# EAGLE design motorthing-tmcm-1110 (EAGLE 7.5.0)
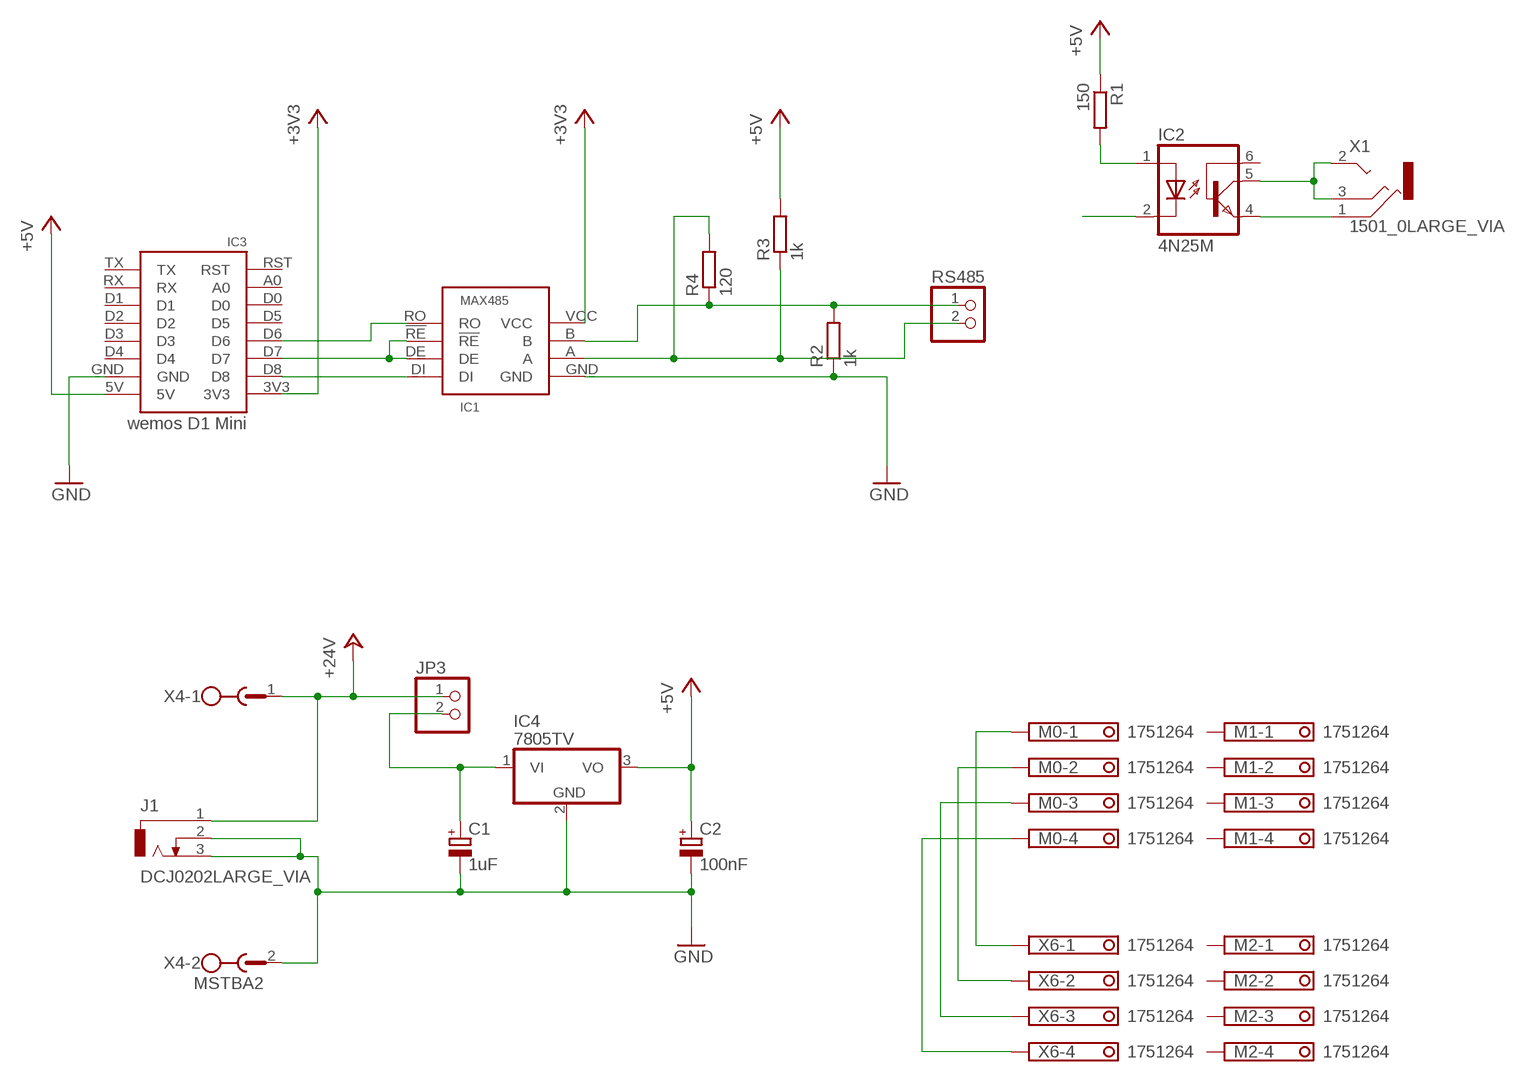
[diagram p0: schematic, sheet 1]

## Parts
C1  1uF  CPOL-EUTT2D6  [TT2D6]
C2  100nF  CPOL-EUTT2D5  [TT2D5]
IC1  MAX485  [DIL08]
IC2  4N25M  [DIL06]
IC3  wemos D1 Mini  WEMOSNOSILK  [WEMOS-NOSILK]
IC4  7805TV  [TO220V]
J1  DCJ0202LARGE_VIA  [DCJ0202_LV]
JP3  PINHD-1X2  [1X02]
M0  1751264  [1751264]
M1  1751264  [1751264]
M2  1751264  [1751264]
R1  150  R-EU_0207/10  [0207/10]
R2  1k  R-EU_0207/10  [0207/10]
R3  1k  R-EU_0207/10  [0207/10]
R4  120  R-EU_0207/10  [0207/10]
RS485  PINHD-1X2  [1X02]
X1  1501_0LARGE_VIA  [1501_05_LV]
X4  MSTBA2  [MSTBA2]
X6  1751264  [1751264]

## Nets
+3V3: IC1.VCC IC3.3V3
+5V [high_voltage]: C2.+ IC3.5V IC4.3(VO) R1.1 R3.2
+24V [high_voltage]: J1.1 JP3.1 X4.1
GND: C1.- C2.- IC1.GND IC3.GND IC4.2(GND) J1.2 J1.3 R2.1 X4.2
N$1: IC2.1(A) R1.2
N$2: IC2.4(EMI) X1.1
N$3: IC1.RO IC3.D6
N$4: IC1.DI IC3.D8
N$5: M0.1 X6.1
N$6: IC2.5(COL) X1.2 X1.3
N$7: M0.2 X6.2
N$8: IC2.2(C)
N$9: M0.3 X6.3
N$10: IC1.!RE IC1.DE IC3.D7
N$11: M0.4 X6.4
N$13 [high_voltage]: C1.+ IC4.1(VI) JP3.2
RS485+: IC1.A R3.1 R4.2 RS485.2
RS485-: IC1.B R2.2 R4.1 RS485.1
Unconnected: IC2.6(BAS) IC3.A0 IC3.D0 IC3.D1 IC3.D2 IC3.D3 IC3.D4 IC3.D5 IC3.RST IC3.RX IC3.TX M1.1 M1.2 M1.3 M1.4 M2.1 M2.2 M2.3 M2.4

## Library data of the parts
C1 C2 = rcl:CPOL-EU: POLARIZED CAPACITOR, European symbol
IC1 = max348x:MAX485
IC2 = optocoupler:4N*?M: General Purpose 6-Pin Phototransistor Optocouplers Source: http://www.fairchildsemi.com/ds/4N/4N35-M.pdf; MPN: 4N25-M; OC_FARNELL: 1021349; OC_NEWARK: 98K9084
IC3 = wemos:WEMOS
IC4 = linear:78*: Positive VOLTAGE REGULATOR Source: http://cache.national.com/ds/LM/LM78L05.pdf http://www.fairchildsemi.com/ds/LM/LM7805.pdf
J1 = myparts:DCJ0202: DC POWER JACK Source: DCJ0202.pdf
JP3 RS485 = pinhead:PINHD-1X2: PIN HEADER
M0 M1 M2 X6 = con-phoenix-350:1751264: MKDS 1/ 4-3,5 Printklemme Nennstrom: 10 A Bemessungsspannung: 160 V Raster: 3,5 mm Polzahl: 4 Montageart: Löten Anschlussart: Schraubanschluss Anschlussrichtung vom Leiter zur Platine: 0° Source: http://eshop.phoenixcontact.com .. 1751264.pdf; MPN: 1751264; OC_FARNELL: unknown; OC_NEWARK: 10R0934
R1-R4 = rcl:R-EU_: RESISTOR, European symbol
X1 = myparts:1501_0*: Jack connectors according to JISC 6560, 2.5 mm Klinkensteckverbinder nach JISC 6560, 2,5 mm Source: http://www.lumberg.com/Produkte/PDFs/1501_05.pdfedit 1501_03 http://www.lumberg.com/Produkte/PDFs/1501_06.pdf
X4 = con-phoenix-508:MSTBA2: PHOENIX; MF: FARNELL; MPN: 1757242; OC_FARNELL: 3705171; OC_NEWARK: 71C4161

## Net classes
0 default: clearance 0.205 mm
1 high_voltage: width 1.016 mm, clearance 0.205 mm to class 0, clearance 0.254 mm

## Board
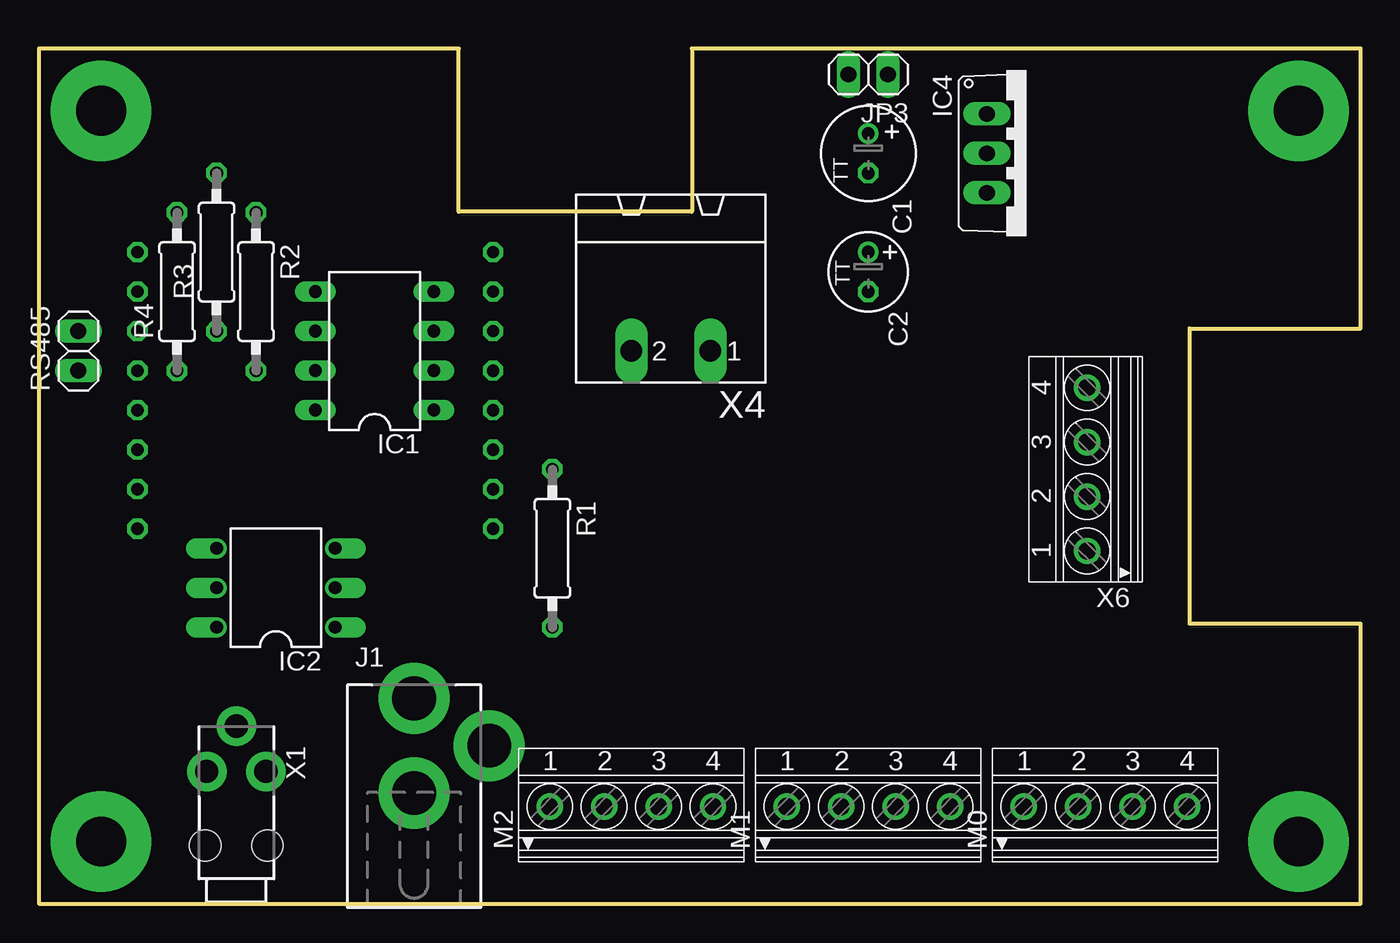
[diagram p1: board, top side]
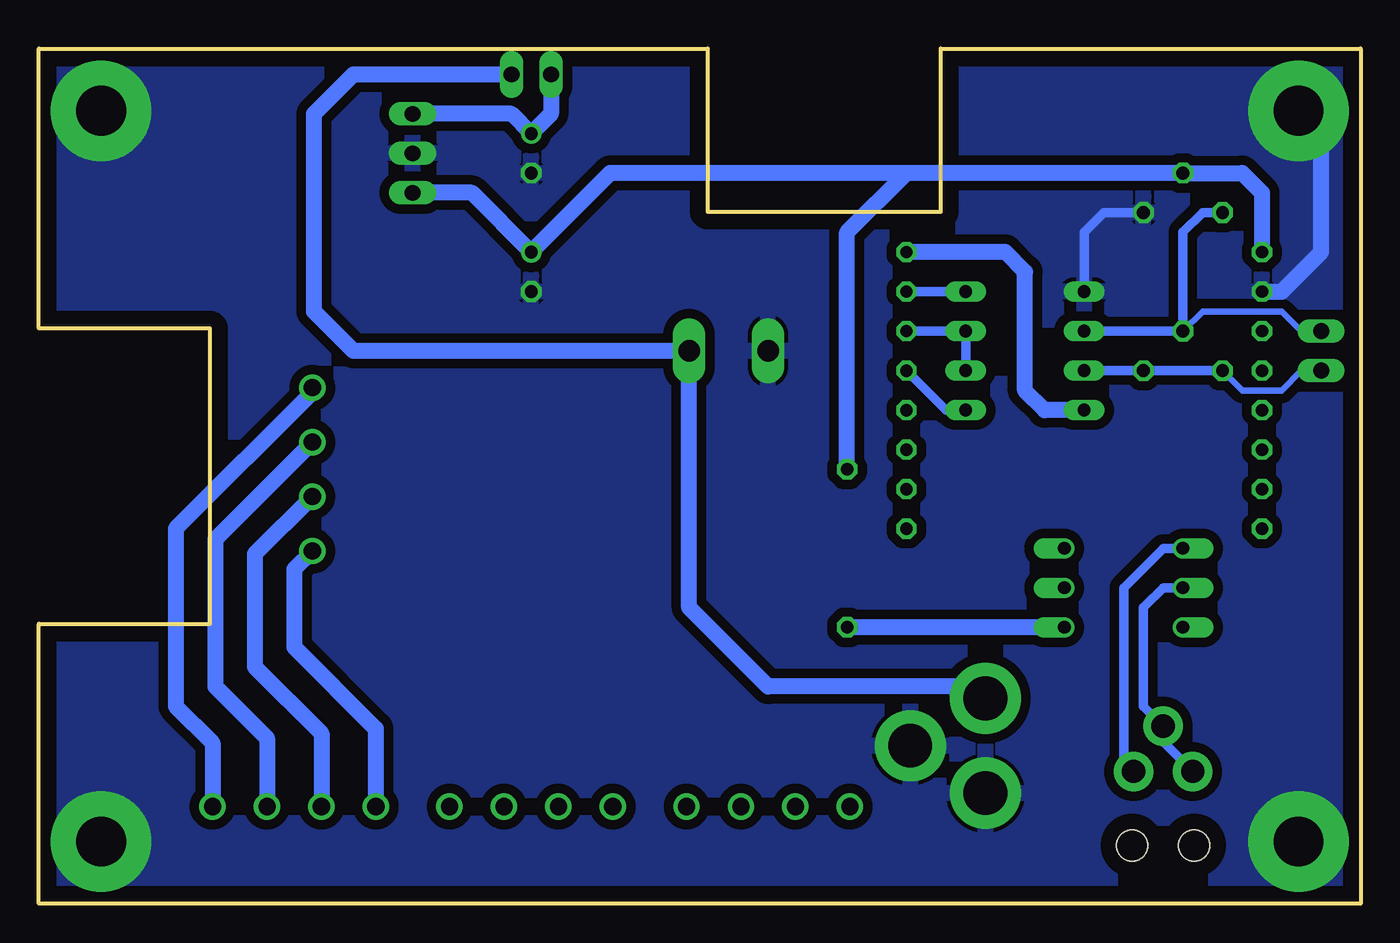
[diagram p2: board, bottom side, seen from below]

Size 85 x 55 mm. Coordinates in mm from the lower left corner, seen from the top.
Outline: 0,0 85,0 85,18 74,18 74,37 85,37 85,55 42,55 42,44.5 27,44.5 27,55 0,55 0,0
Copper layers (1*16): Top 0.035mm / dielectric 1.5mm / Bottom 0.035mm
Design rules "default": minimum track width 10mil, minimum drill 24mil, track to track 8mil, track to pad 8mil, pad to pad 8mil, via to via 8mil, smd to smd 8mil, copper to edge 40mil, drill to drill 8mil, minimum pad ring 10mil, minimum via ring 8mil, stop-mask expansion 4mil, vias tented up to drill 0mil, thermal gap 10mil
tKeepout: area 33,45.7 to 48.3,55.9; area 71.1,20.3 to 86.4,35.6; area 30.5,-1.3 to 76.2,2.5

### Footprints (pad centres in the part's own frame; a part is rotated, then mirrored left to right if it is on the bottom)
TT2D6 = drill 0.813: + -1.27,0 | drill 0.813 octagon: - 1.27,0
TT2D5 = drill 0.813: + -1.27,0 | drill 0.813 octagon: - 1.27,0
DIL08 = drill 0.813 long: !RE -1.27,-3.81; A 1.27,3.81; B -1.27,3.81; DE 1.27,-3.81; DI 3.81,-3.81; GND 3.81,3.81; RO -3.81,-3.81; VCC -3.81,3.81
DIL06 = drill 0.813 offset: 1 -2.54,-3.81; 2 0,-3.81; 3 2.54,-3.81; 4 2.54,3.81; 5 0,3.81; 6 -2.54,3.81
WEMOS-NOSILK = drill 0.8 octagon: 3V3 0,0; 5V 22.86,0; A0 0,15.24; D0 0,12.7; D1 22.86,12.7; D2 22.86,10.16; D3 22.86,7.62; D4 22.86,5.08; D5 0,10.16; D6 0,7.62; D7 0,5.08; D8 0,2.54; GND 22.86,2.54; RST 0,17.78; RX 22.86,15.24; TX 22.86,17.78
TO220V = drill 1.016 long: 1 -2.54,-2.54; 2 0,-2.54; 3 2.54,-2.54
DCJ0202_LV = drill 2.8 pad 4.572: 1 0,3.048; 2 4.826,0; 3 0,-3.048
1X02 = drill 1.016 long: 1 -1.27,0; 2 1.27,0
1751264 = drill 1.1 pad 1.7: 1 -5.25,-0.1; 2 -1.75,-0.1; 3 1.75,-0.1; 4 5.25,-0.1
0207/10 = drill 0.813 octagon: 1 -5.08,0; 2 5.08,0
1501_05_LV = drill 1.5 pad 2.54: 1 -1.905,-8.509; 2 0,-11.43; 3 1.905,-8.509 | hole 2: -2,-3.75; 2,-3.75
MSTBA2 = drill 1.397 long: 1 -2.54,5.08; 2 2.54,5.08

### Placement (x,y rotation side)
C1  53.34,48.26 270 top
C2  53.34,40.64 270 top
IC1  21.59,35.56 90 top
IC2  15.24,20.32 90 top
IC3  29.21,41.91 180 top
IC4  63.5,48.26 270 top
J1  24.13,10.16 0 top
JP3  53.34,53.34 180 top
M0  68.58,6.35 0 top
M1  53.34,6.35 0 top
M2  38.1,6.35 0 top
R1  33.02,22.86 270 top
R2  13.97,39.37 270 top
R3  11.43,41.91 90 top
R4  8.89,39.37 90 top
RS485  2.54,35.56 90 top
X1  12.7,0 180 top
X4  40.64,40.64 180 top
X6  67.31,27.94 90 top

### Tracks (layer width: path | path; a pad name or v marks a point on that pad's centre or on a via)
+3V3
  Bottom 1.016: IC1.VCC 20.32,31.75 21.59,33.02 21.59,40.64 22.86,41.91 IC3.3V3
+5V
  Bottom 1.016: 29.21,46.99 R3.2 7.62,46.99 6.35,45.72 IC3.5V | 29.21,46.99 48.26,46.99 C2.+ 57.15,45.72 IC4.3 | R1.1 33.02,43.18 29.21,46.99
+24V
  Bottom 1.016: J1.1 24.13,13.97 38.1,13.97 43.18,19.05 X4.1 64.77,35.56 67.31,38.1 67.31,50.8 64.77,53.34 JP3.1
GND  (via drill 3.2 pad 6.45)
  Bottom 0.61: R2.1 16.51,44.45 17.78,43.18 IC1.GND
  Bottom 1.016: IC3.GND 5.08,39.37 2.54,41.91 2.54,49.54 v4,51
  other vias: 81,51 81,4 4,4
  pour Bottom (isolate 0.61): 0,0 85.09,0 85.09,54.61 0,54.61
N$1
  Bottom 1.016: IC2.1 R1.2
N$2
  Bottom 0.61: IC2.4 12.7,22.86 15.24,20.32 15.24,9.14 X1.1
N$3
  Bottom 0.61: IC1.RO 26.67,31.75 IC3.D6
N$4
  Bottom 0.61: IC1.DI IC3.D8
N$5
  Bottom 1.016: X6.1 68.58,21.52 68.58,16.51 63.33,11.26 M0.1
N$6
  Bottom 0.61: IC2.5 12.7,20.32 13.97,19.05 13.97,12.7 X1.2 12.7,10.41 X1.3
N$7
  Bottom 1.016: X6.2 71.12,22.48 71.12,15.24 66.83,10.95 M0.2
N$9
  Bottom 1.016: X6.3 73.66,23.44 73.66,13.97 70.33,10.64 M0.3
N$10
  Bottom 0.61: IC3.D7 IC1.DE IC1.!RE
N$11
  Bottom 1.016: X6.4 67.41,33.12 67.31,33.02 76.2,24.13 76.2,12.7 73.83,10.33 M0.4
N$13
  Bottom 1.016: IC4.1 54.61,50.8 C1.+ 52.07,50.8 JP3.2
RS485+
  Bottom 0.406: RS485.2 3.81,36.83 5.08,38.1 10.16,38.1 R3.1
  Bottom 0.61: IC1.A R3.1 11.43,43.18 10.16,44.45 R4.2
RS485-
  Bottom 0.406: RS485.1 3.81,34.29 5.08,33.02 7.62,33.02 R4.1
  Bottom 0.61: R4.1 R2.2 IC1.B